# Altium project TMDX654GPEVM.PrjPcb (part 5 of 24)

## Sheet 19-EEPROM,PRESENCE DETECTION & TEMP SENSOR.SchDoc
size 513 x 386 mm
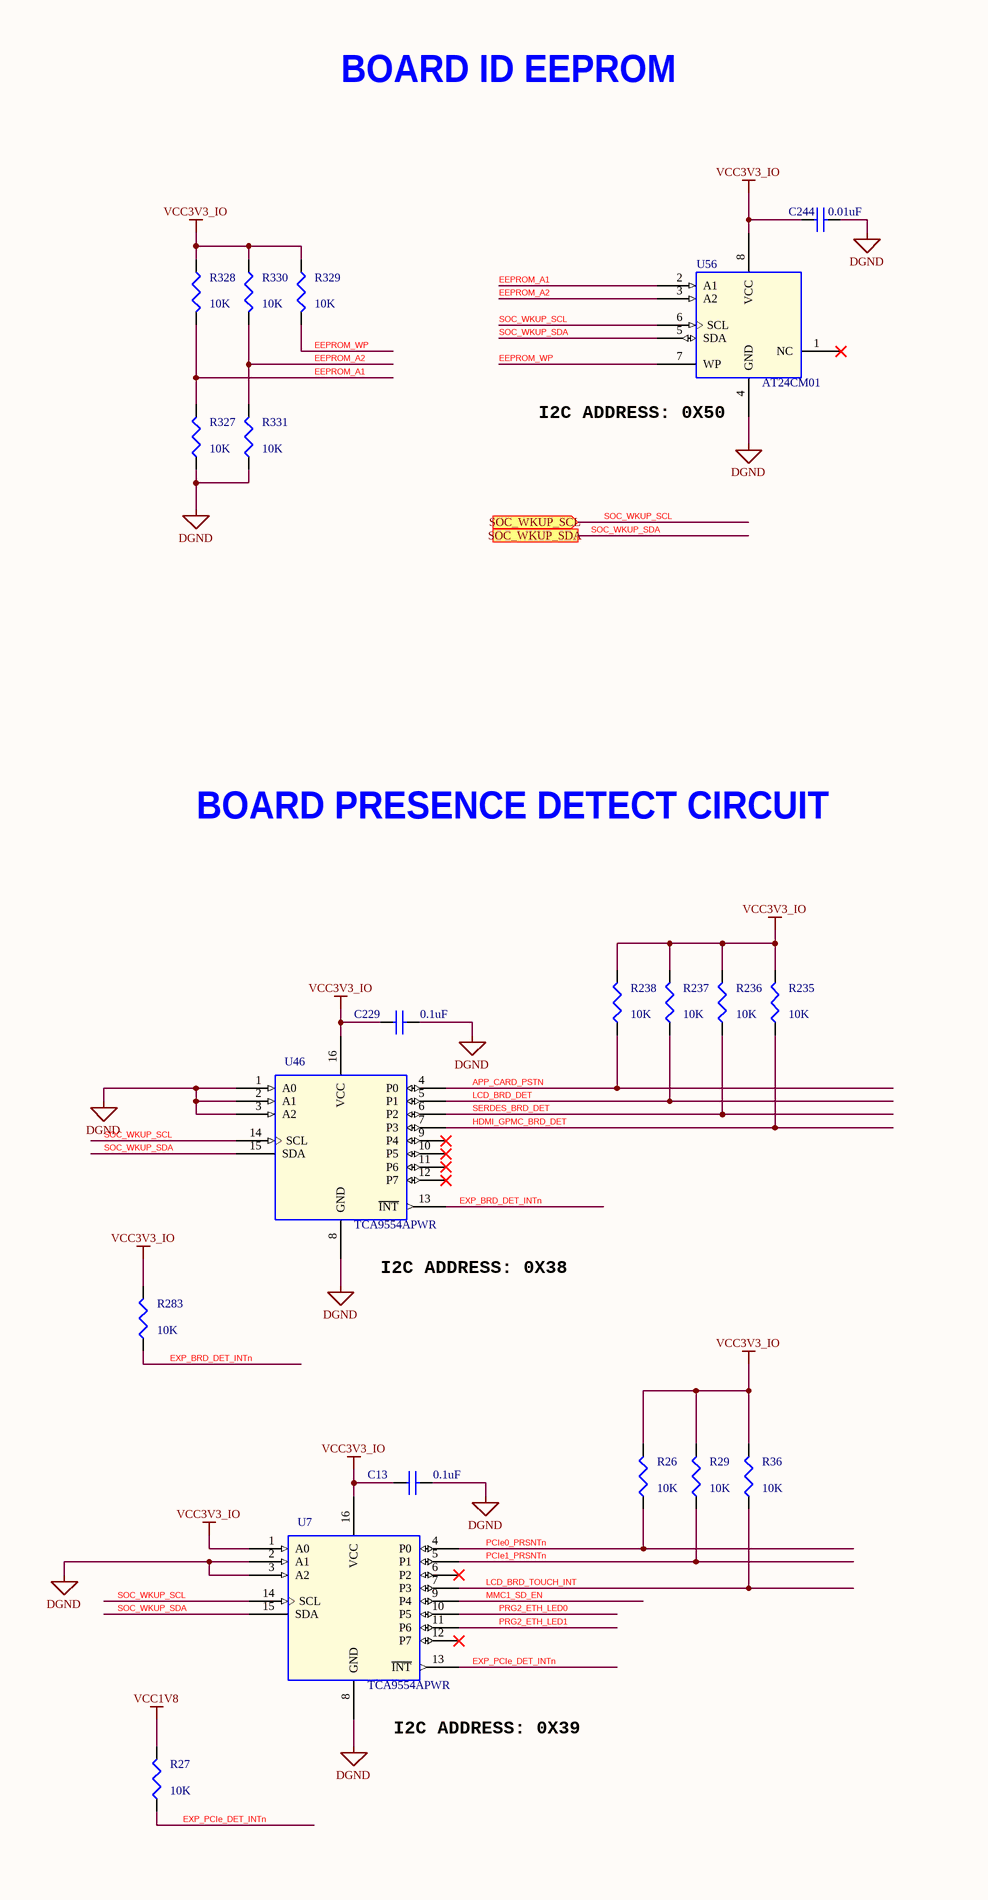
[diagram p30: 19-EEPROM,PRESENCE DETECTION & TEMP SENSOR.SchDoc, left]
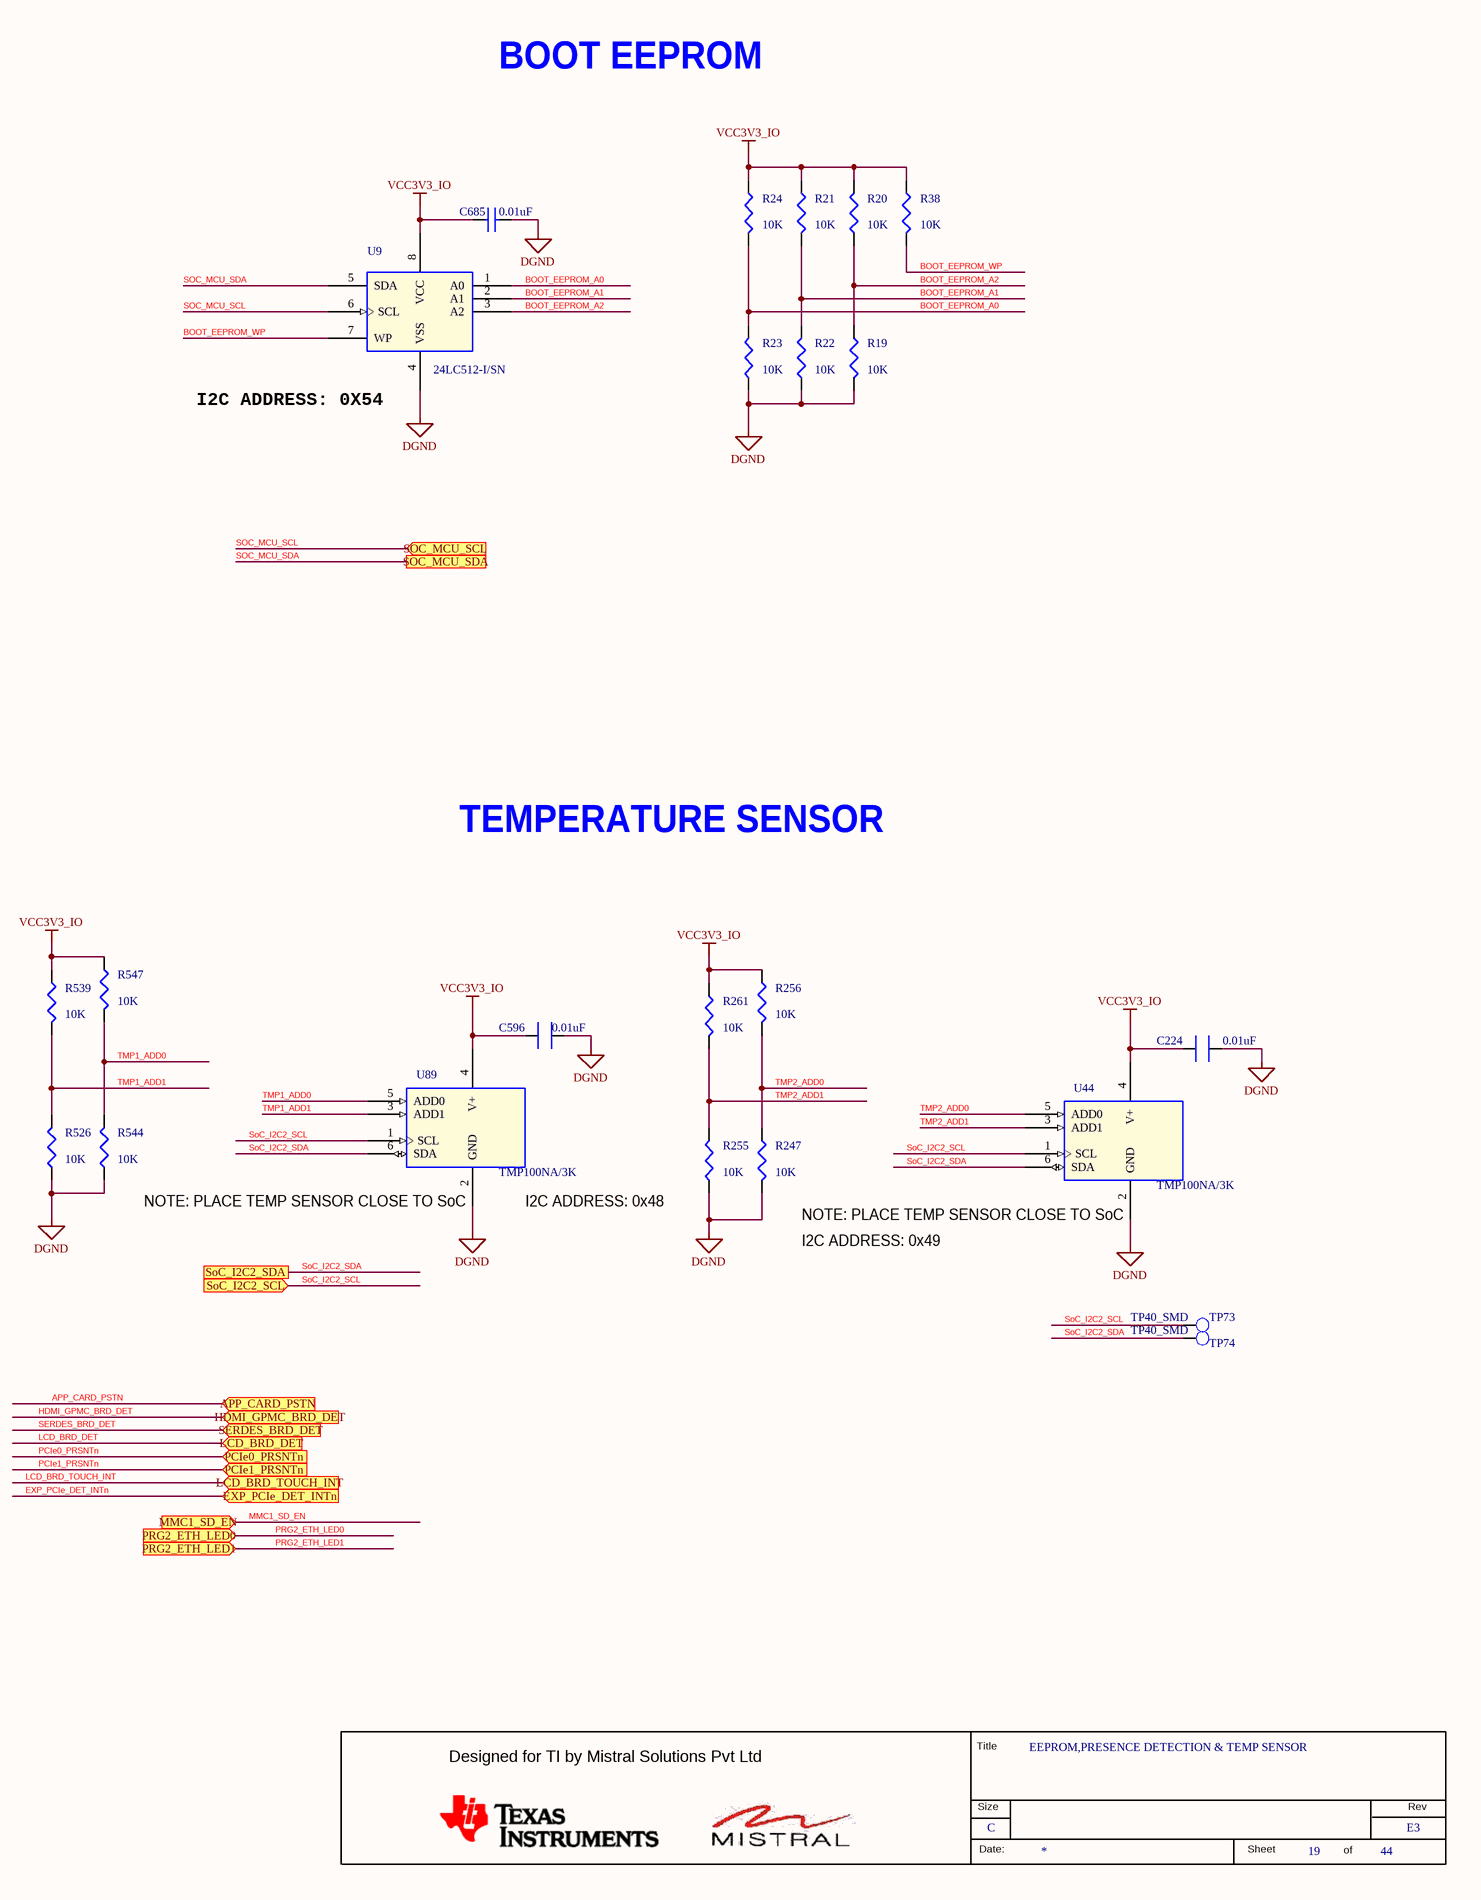
[diagram p31: 19-EEPROM,PRESENCE DETECTION & TEMP SENSOR.SchDoc, right]

### Parts
(Parts that share a designator on the sheet are numbered #1, #2 ... from top to bottom, then left to right.)
*#19  RevCode: E3  Title: EEPROM,PRESENCE DETECTION & TEMP SENSOR  Page Size: C  Page Number: 19  Page Count: 44  (hidden comment: MISTRAL_TITLEBLK_CSIZE)  (graphical)
C13  0.1uF  [CAP0201_0-5]
C224  0.01uF  [CAP0201_0-5]
C229  0.1uF  [CAP0201_0-5]
C244  0.01uF  [CAP0201_0-5]
C596  0.01uF  [CAP0201_0-5]
C685  0.01uF  [CAP0201_0-5]
R19  10K  [RES0402_0-5]
R20  10K  [RES0402_0-5]
R21  10K  [RES0402_0-5]
R22  10K  [RES0402_0-5]
R23  10K  [RES0402_0-5]
R24  10K  [RES0402_0-5]
R26  10K  [RES0402_0-5]
R27  10K  [RES0402_0-5]
R29  10K  [RES0402_0-5]
R36  10K  [RES0402_0-5]
R38  10K  [RES0402_0-5]
R235  10K  [RES0402_0-5]
R236  10K  [RES0402_0-5]
R237  10K  [RES0402_0-5]
R238  10K  [RES0402_0-5]
R247  10K  [RES0402_0-5]
R255  10K  [RES0402_0-5]
R256  10K  [RES0402_0-5]
R261  10K  [RES0402_0-5]
R283  10K  [RES0402_0-5]
R327  10K  [RES0402_0-5]
R328  10K  [RES0402_0-5]
R329  10K  [RES0402_0-5]
R330  10K  [RES0402_0-5]
R331  10K  [RES0402_0-5]
R526  10K  [RES0402_0-5]
R539  10K  [RES0402_0-5]
R544  10K  [RES0402_0-5]
R547  10K  [RES0402_0-5]
TP73  TP40_SMD  [TP40_SMD]
TP74  TP40_SMD  [TP40_SMD]
U7  TCA9554APWR  [TSSOP16_25-59_205X180_1-2]
U9  24LC512-I/SN  [SOIC8_1-8]
U44  TMP100NA/3K  [SOT23-6_1-5]
U46  TCA9554APWR  [TSSOP16_25-59_205X180_1-2]
U56  AT24CM01  [TSSOP8_25-59_125X180_1-2]
U89  TMP100NA/3K  [SOT23-6_1-5]

### Ports
APP_CARD_PSTN (in), EXP_PCIe_DET_INTn (in), HDMI_GPMC_BRD_DET (in), LCD_BRD_DET (in), LCD_BRD_TOUCH_INT (in), MMC1_SD_EN (in), PCIe0_PRSNTn (in), PCIe1_PRSNTn (in), PRG2_ETH_LED0 (in), PRG2_ETH_LED1 (in), SERDES_BRD_DET (in), SoC_I2C2_SCL (in), SoC_I2C2_SDA, SOC_MCU_SCL (in), SOC_MCU_SDA, SOC_WKUP_SCL (in), SOC_WKUP_SDA

### Nets
DGND: C13.2 C224.1 C229.2 C244.2 C596.1 C685.2 R19.2 R22.1 R23.1 R247.2 R255.1 R327.1 R331.1 R526.1 R544.1 U7.2(A1) U7.3(A2) U7.8(GND) U9.4(VSS) U44.2(GND) U46.1(A0) U46.2(A1) U46.3(A2) U46.8(GND) U56.4(GND) U89.2(GND)
VCC1V8: R27.2
VCC3V3_IO: C13.1 C224.2 C229.1 C244.1 C596.2 C685.1 R20.2 R21.1 R24.1 R26.2 R29.2 R36.2 R38.1 R235.2 R236.2 R237.2 R238.2 R256.1 R261.1 R283.2 R328.1 R329.1 R330.1 R539.1 R547.1 U7.1(A0) U7.16(VCC) U9.8(VCC) U44.4(V+) U46.16(VCC) U56.8(VCC) U89.4(V+)
APP_CARD_PSTN: R238.1 U46.4(P0) ; port APP_CARD_PSTN
BOOT_EEPROM_A0: R23.2 R24.2 U9.1(A0)
BOOT_EEPROM_A1: R21.2 R22.2 U9.2(A1)
BOOT_EEPROM_A2: R19.1 R20.1 U9.3(A2)
BOOT_EEPROM_WP: R38.2 U9.7(WP)
EEPROM_A1: R327.2 R328.2 U56.2(A1)
EEPROM_A2: R330.2 R331.2 U56.3(A2)
EEPROM_WP: R329.2 U56.7(WP)
EXP_BRD_DET_INTn: R283.1 U46.13(~{INT})
EXP_PCIe_DET_INTn: R27.1 U7.13(~{INT}) ; port EXP_PCIe_DET_INTn
HDMI_GPMC_BRD_DET: R235.1 U46.7(P3) ; port HDMI_GPMC_BRD_DET
LCD_BRD_DET: R237.1 U46.5(P1) ; port LCD_BRD_DET
LCD_BRD_TOUCH_INT: R36.1 U7.7(P3) ; port LCD_BRD_TOUCH_INT
MMC1_SD_EN: U7.9(P4) ; port MMC1_SD_EN
PCIe0_PRSNTn: R26.1 U7.4(P0) ; port PCIe0_PRSNTn
PCIe1_PRSNTn: R29.1 U7.5(P1) ; port PCIe1_PRSNTn
PRG2_ETH_LED0: U7.10(P5) ; port PRG2_ETH_LED0
PRG2_ETH_LED1: U7.11(P6) ; port PRG2_ETH_LED1
SERDES_BRD_DET: R236.1 U46.6(P2) ; port SERDES_BRD_DET
SoC_I2C2_SCL: TP73.1(TP) U44.1(SCL) U89.1(SCL) ; port SoC_I2C2_SCL
SoC_I2C2_SDA: TP74.1(TP) U44.6(SDA) U89.6(SDA) ; port SoC_I2C2_SDA
SOC_MCU_SCL: U9.6(SCL) ; port SOC_MCU_SCL
SOC_MCU_SDA: U9.5(SDA) ; port SOC_MCU_SDA
SOC_WKUP_SCL: U7.14(SCL) U46.14(SCL) U56.6(SCL) ; port SOC_WKUP_SCL
SOC_WKUP_SDA: U7.15(SDA) U46.15(SDA) U56.5(SDA) ; port SOC_WKUP_SDA
TMP1_ADD0: R544.2 R547.2 U89.5(ADD0)
TMP1_ADD1: R526.2 R539.2 U89.3(ADD1)
TMP2_ADD0: R247.1 R256.2 U44.5(ADD0)
TMP2_ADD1: R255.2 R261.2 U44.3(ADD1)

Not connected (* = marked no-connect by the designer): U7 6(P2)* 12(P7)*; U46 9(P4)* 10(P5)* 11(P6)* 12(P7)*; U56 1(NC)*

### Notes on the sheet
- BOARD ID EEPROM
- BOOT EEPROM
- (near U56) I2C ADDRESS: 0X50
- (near U9) I2C ADDRESS: 0X54
- BOARD PRESENCE DETECT CIRCUIT
- TEMPERATURE SENSOR
- (near U89) NOTE: PLACE TEMP SENSOR CLOSE TO SoC
- I2C ADDRESS: 0x48
- (near U44) NOTE: PLACE TEMP SENSOR CLOSE TO SoC
- I2C ADDRESS: 0x49
- (near U46) I2C ADDRESS: 0X38
- (near U7) I2C ADDRESS: 0X39
- (in symbol MISTRAL_TITLEBLK_CSIZE) Title; Designed for TI by Mistral Solutions Pvt Ltd; Size; Rev; Date:; Sheet; of

### Library data of the parts
*#19 = MISTRAL_TITLEBLK_CSIZE: Issue: 1.0; Page Create Date: March  8, 1995; Page Modify Date: *
C13 C229 = CAP_Dup5: CAP CERAMIC 0.1uF 16V 10% X5R 0201; Part_type: CAPACITORS\CERAMIC; Mfr_part_number: GRM033R61C104KE84J; Mfr_name: MURATA; Mistral Part No: 120009030072-R; Custom_Duty: 15%; Customs_HS_Code: 85322990; Wattage: NA; Project: TI_MAXIE_CPB; Library Ref: CAP; PCB Footprint: CAP0201_0-5; MECHANICAL 3D STEP FILE: CAP0201_0-5; Chkd/date: MANIRAJA/120218; Crtd /date: MANIRAJA/120218; Datasheet: Y:\MIS_DATABASE\DATASHEETS\CAPACITORS\GRM033R61C104KE84.PDF; Temperature: -55°C+85°C; Weight: 0.33mg; Height: 0.33MM; Distributor_part_number: 490-16742-1-ND; Distributor_name: DIGIKEY; Package: 0201; Voltage: 16V; Tolerance: 10%
C224 C596 = CAP_Dup3: CAP CERAMIC 0.01uF 25V 10% X5R 0201; Mistral Part No: 120018010007-R; Mfr_name: MURATA; Mfr_part_number: GRM033R61E103KA12J; Part_type: CAPACITORS\CERAMIC; Project: TI_MAXIE_CPB; Customs_HS_Code: 85322990; Custom_Duty: 15%; Wattage: NA; Library Ref: CAP; PCB Footprint: CAP0201_0-5; Tolerance: 10%; Voltage: 25V; Package: 0201; Distributor_name: DIGIKEY; Distributor_part_number: GRM033R61E103KA12J-ND; Height: 0.33MM; Datasheet: Y:\MIS_DATABASE\DATASHEETS\CAPACITORS\GRM033R61E103KA12.PDF; Crtd /date: MANIRAJA/230118; Chkd/date: MANIRAJA/230118; Weight: 0.33mg; Temperature: -55°C+85°C; MECHANICAL 3D STEP FILE: CAP0201_0-5
C244 C685 = CAP_Dup5: CAP CERAMIC 0.01uF 25V 10% X5R 0201; Mistral Part No: 120018010007-R; Mfr_name: MURATA; Mfr_part_number: GRM033R61E103KA12J; Part_type: CAPACITORS\CERAMIC; Wattage: NA; Project: TI_MAXIE_CPB; Customs_HS_Code: 85322990; Custom_Duty: 15%; Library Ref: CAP; MECHANICAL 3D STEP FILE: CAP0201_0-5; Temperature: -55°C+85°C; Weight: 0.33mg; Tolerance: 10%; Voltage: 25V; Package: 0201; Distributor_name: DIGIKEY; Distributor_part_number: GRM033R61E103KA12J-ND; Height: 0.33MM; Datasheet: Y:\MIS_DATABASE\DATASHEETS\CAPACITORS\GRM033R61E103KA12.PDF; Crtd /date: MANIRAJA/230118; Chkd/date: MANIRAJA/230118; PCB Footprint: CAP0201_0-5
R19 R24 R29 R36 R247 R330 R539 R547 = RESISTOR_Dup5: RES 10K 1/16W 5% 0402; Mistral Part No: 110009030208-R; Mfr_name: YAGEO AMERICA; Mfr_part_number: RC0402JR-0710KL; Part_type: RESISTORS\FIXED; Project: HSE; Voltage: NA; Customs_HS_Code: 85332119; Custom_Duty: 15%; NI_MARK: DNI; Footprint Path: Y:\MIS_DATABASE\Library\ALTIUM_TOOL\PCB_FOOTPRINTS\Altium_Footprint_Lib.PcbLib; Library Path: Y:\MIS_DATABASE\Library\ALTIUM_TOOL\SCHEMATICS_PARTS\MS_DISCRETE_Library.schlib; Footprint Ref: RES0402_0-5; Library Ref: RESISTOR; Tolerance: 5%; Wattage: 1/16W; Package: 0402; Distributor_name: DIGIKEY; Distributor_part_number: 311-10KJRCT-ND; Height: 0.40MM; Weight: 0.65mg; Temperature: -55°C+155°C; Datasheet: Y:\MIS_DATABASE\DATASHEETS\RESISTORS\YAGEO-RC0402.PDF; Crtd /date: MAZHAR/230805; Chkd/date: VASANTHA/061216; RoHS: Pb-Free; MECHANICAL 3D STEP FILE: RES0402_0-5; PCB Footprint: RES0402_0-5
R20 R23 R236 R238 R331 R526 = RESISTOR_Dup5: RES 10K 1/16W 5% 0402; Part_type: RESISTORS\FIXED; Mfr_part_number: RC0402JR-0710KL; Mfr_name: YAGEO AMERICA; Mistral Part No: 110009030208-R; Custom_Duty: 15%; Customs_HS_Code: 85332119; Voltage: NA; Project: HSE; Footprint Path: Y:\MIS_DATABASE\Library\ALTIUM_TOOL\PCB_FOOTPRINTS\Altium_Footprint_Lib.PcbLib; Library Path: Y:\MIS_DATABASE\Library\ALTIUM_TOOL\SCHEMATICS_PARTS\MS_DISCRETE_Library.schlib; Footprint Ref: RES0402_0-5; Library Ref: RESISTOR; MECHANICAL 3D STEP FILE: RES0402_0-5; RoHS: Pb-Free; Chkd/date: VASANTHA/061216; Crtd /date: MAZHAR/230805; Datasheet: Y:\MIS_DATABASE\DATASHEETS\RESISTORS\YAGEO-RC0402.PDF; Temperature: -55°C+155°C; Weight: 0.65mg; Height: 0.40MM; Distributor_part_number: 311-10KJRCT-ND; Distributor_name: DIGIKEY; Package: 0402; Wattage: 1/16W; Tolerance: 5%; PCB Footprint: RES0402_0-5
R21 R26 R38 R256 R261 R328 R329 = RESISTOR_Dup5: RES 10K 1/16W 5% 0402; Part_type: RESISTORS\FIXED; Mfr_part_number: RC0402JR-0710KL; Mfr_name: YAGEO AMERICA; Mistral Part No: 110009030208-R; Custom_Duty: 15%; Customs_HS_Code: 85332119; Voltage: NA; Project: HSE; NI_MARK: DNI; Footprint Path: Y:\MIS_DATABASE\Library\ALTIUM_TOOL\PCB_FOOTPRINTS\Altium_Footprint_Lib.PcbLib; Library Path: Y:\MIS_DATABASE\Library\ALTIUM_TOOL\SCHEMATICS_PARTS\MS_DISCRETE_Library.schlib; Footprint Ref: RES0402_0-5; Library Ref: RESISTOR; MECHANICAL 3D STEP FILE: RES0402_0-5; RoHS: Pb-Free; Chkd/date: VASANTHA/061216; Crtd /date: MAZHAR/230805; Datasheet: Y:\MIS_DATABASE\DATASHEETS\RESISTORS\YAGEO-RC0402.PDF; Temperature: -55°C+155°C; Weight: 0.65mg; Height: 0.40MM; Distributor_part_number: 311-10KJRCT-ND; Distributor_name: DIGIKEY; Package: 0402; Wattage: 1/16W; Tolerance: 5%; PCB Footprint: RES0402_0-5
R22 R27 R235 R237 R255 R283 R327 R544 = RESISTOR_Dup5: RES 10K 1/16W 5% 0402; Mistral Part No: 110009030208-R; Mfr_name: YAGEO AMERICA; Mfr_part_number: RC0402JR-0710KL; Part_type: RESISTORS\FIXED; Project: HSE; Voltage: NA; Customs_HS_Code: 85332119; Custom_Duty: 15%; Footprint Path: Y:\MIS_DATABASE\Library\ALTIUM_TOOL\PCB_FOOTPRINTS\Altium_Footprint_Lib.PcbLib; Library Path: Y:\MIS_DATABASE\Library\ALTIUM_TOOL\SCHEMATICS_PARTS\MS_DISCRETE_Library.schlib; Footprint Ref: RES0402_0-5; Library Ref: RESISTOR; Tolerance: 5%; Wattage: 1/16W; Package: 0402; Distributor_name: DIGIKEY; Distributor_part_number: 311-10KJRCT-ND; Height: 0.40MM; Weight: 0.65mg; Temperature: -55°C+155°C; Datasheet: Y:\MIS_DATABASE\DATASHEETS\RESISTORS\YAGEO-RC0402.PDF; Crtd /date: MAZHAR/230805; Chkd/date: VASANTHA/061216; RoHS: Pb-Free; MECHANICAL 3D STEP FILE: RES0402_0-5; PCB Footprint: RES0402_0-5
TP73 = TESTPOINT: TESTPOINT CIR 40 SMD; Mfr_name: LOCAL; Mistral Part No: 130009030933; MECHANICAL 3D STEP FILE: NA; Project: RAINIER-3; NI_MARK: DNI; RoHS: NA; Footprint Ref: TP40_SMD; Library Ref: TESTPOINT; Footprint Path: Y:\MIS_DATABASE\Library\ALTIUM_TOOL\PCB_FOOTPRINTS\Altium_Footprint_Lib.PcbLib; Library Path: Y:\MIS_DATABASE\Library\ALTIUM_TOOL\SCHEMATICS_PARTS\MS_DISCRETE_Library.schlib; Datasheet: NA; Temperature: NA; Weight: NA; Wattage: NA; Voltage: NA; Tolerance: NA; Chkd/date: MAZHAR/190505; Crtd /date: MAZHAR/190505; Height: NA; Distributor_part_number: NA; Distributor_name: NA; Package: SMD; Part_type: TESTPOINT; Mfr_part_number: TP40_SMD; PCB Footprint: TP40_SMD
TP74 = TESTPOINT: TESTPOINT CIR 40 SMD; Mistral Part No: 130009030933; Mfr_name: LOCAL; Project: RAINIER-3; Tolerance: NA; NI_MARK: DNI; RoHS: NA; Footprint Ref: TP40_SMD; Library Ref: TESTPOINT; Mfr_part_number: TP40_SMD; Part_type: TESTPOINT; Package: SMD; Distributor_name: NA; Distributor_part_number: NA; Height: NA; Crtd /date: MAZHAR/190505; Chkd/date: MAZHAR/190505; Voltage: NA; Wattage: NA; Weight: NA; Temperature: NA; Datasheet: NA; MECHANICAL 3D STEP FILE: NA; Library Path: Y:\MIS_DATABASE\Library\ALTIUM_TOOL\SCHEMATICS_PARTS\MS_DISCRETE_Library.schlib; Footprint Path: Y:\MIS_DATABASE\Library\ALTIUM_TOOL\PCB_FOOTPRINTS\Altium_Footprint_Lib.PcbLib; PCB Footprint: TP40_SMD
U7 U46 = TCA9554APWR_TSSOP16: IC 8-BIT I2C AND SMBUS I/O EXPANDER WITH INTERRUPT O/P TSSOP16; Mistral Part No: 141017090007-R; Mfr_name: TEXAS INSTRUMENTS; Part_type: ICS\DIGITAL\BUSTRANSCEIVER; Project: TI_MAXIE_CPB; Tolerance: NA; Customs_HS_Code: 85423100; Custom_Duty: 15%; Library Ref: TCA9554APWR_TSSOP16; Mfr_part_number: TCA9554APWR; Voltage: NA; Wattage: NA; Package: TSSOP16; Distributor_name: DIGIKEY; Distributor_part_number: 296-28120-1-ND; Height: 1.20MM; Weight: 173mg; Temperature: -40°C+85°C; Datasheet: Y:\MIS_DATABASE\DATASHEETS\ICS\DIGITAL\BUSTRANSCEIVER\TCA9554.PDF; Crtd /date: MANIRAJA/110917; Chkd/date: MANIRAJA/110917; MECHANICAL 3D STEP FILE: TSSOP16_25-59_205X180_1-2; PCB Footprint: TSSOP16_25-59_205X180_1-2
U9 = 24LC512-ESN_SOIC8: IC 512K I2C SERIAL EEPROM MEMORY SOIC8; Mistral Part No: 141117080005-R; Mfr_name: MICROCHIP; Part_type: ICS\DIGITAL\MEMORY; Project: TI_MAXIE_CPB; Tolerance: NA; Customs_HS_Code: 85423100; Custom_Duty: 15%; Library Ref: 24LC512-ESN_SOIC8; Mfr_part_number: 24LC512-I/SN; Voltage: NA; Wattage: NA; Package: SOIC8; Distributor_name: DIGIKEY; Distributor_part_number: 24LC512-I/SN-ND; Height: 1.75MM; Weight: 540mg; Temperature: -40°C+85°C; Datasheet: Y:\MIS_DATABASE\DATASHEETS\ICS\MEMORY\24LC512.PDF; Crtd /date: MANIRAJA/220817; Chkd/date: MANIRAJA/220817; MECHANICAL 3D STEP FILE: SOIC8_1-8; PCB Footprint: SOIC8_1-8
U44 = TMP100NA/3K_SOT23-6: IC TEMPERATURE SENSOR WITH I2C AND SMBUS INTERFACE SOT23-6; Part_type: ICS\DIGITAL\PERIPHERAL; Mfr_name: TEXAS INSTRUMENTS; Mistral Part No: 141017080030-R; Custom_Duty: 15%; Customs_HS_Code: 85423100; Wattage: NA; Project: TI_MAXIE_CPB; Library Ref: TMP100NA/3K_SOT23-6; MECHANICAL 3D STEP FILE: SOT23-6_1-5; Chkd/date: MANIRAJA/290817; Crtd /date: MANIRAJA/290817; Datasheet: Y:\MIS_DATABASE\DATASHEETS\ICS\DIGITAL\PERIPHERAL\TMP10XX.PDF; Temperature: -55°C+125°C; Weight: 120mg; Height: 1.45MM; Distributor_part_number: 296-26833-1-ND; Distributor_name: DIGIKEY; Package: SOT23-6; Voltage: NA; Tolerance: NA; Mfr_part_number: TMP100NA/3K; PCB Footprint: SOT23-6_1-5
U56 = AT24HC04B-TH-B_TSSOP8: IC 1MBIT I2C SERIAL EEPROM TSSOP8; Mistral Part No: 141114090006-R; Mfr_name: ATMEL; Mfr_part_number: AT24CM01-XHD-T; Part_type: ICS\DIGITAL\MEMORY; Project: GALILEO_EVM; Tolerance: NA; Customs_HS_Code: 85423100; Custom_Duty: 15%; Library Ref: AT24HC04B-TH-B_TSSOP8; Voltage: NA; Wattage: NA; Package: TSSOP8; Distributor_name: DIGIKEY; Distributor_part_number: AT24CM01-XHD-TCT-ND; Height: 1.20MM; Weight: 158mg; Temperature: -40°C+85°C; Datasheet: Y:\MIS_DATABASE\DATASHEETS\ICS\MEMORY\AT24CM01.PDF; Crtd /date: VASANTHA/230914; Chkd/date: NAVEED/241114; MECHANICAL 3D STEP FILE: TSSOP8_25-59_125X180_1-2; PCB Footprint: TSSOP8_25-59_125X180_1-2
U89 = TMP100NA/3K_SOT23-6: IC TEMPERATURE SENSOR WITH I2C AND SMBUS INTERFACE SOT23-6; Mistral Part No: 141017080030-R; Mfr_name: TEXAS INSTRUMENTS; Part_type: ICS\DIGITAL\PERIPHERAL; Project: TI_MAXIE_CPB; Tolerance: NA; Customs_HS_Code: 85423100; Custom_Duty: 15%; Library Ref: TMP100NA/3K_SOT23-6; Mfr_part_number: TMP100NA/3K; Voltage: NA; Wattage: NA; Package: SOT23-6; Distributor_name: DIGIKEY; Distributor_part_number: 296-26833-1-ND; Height: 1.45MM; Weight: 120mg; Temperature: -55°C+125°C; Datasheet: Y:\MIS_DATABASE\DATASHEETS\ICS\DIGITAL\PERIPHERAL\TMP10XX.PDF; Crtd /date: MANIRAJA/290817; Chkd/date: MANIRAJA/290817; MECHANICAL 3D STEP FILE: SOT23-6_1-5; PCB Footprint: SOT23-6_1-5